# EAGLE schematic Schematic (EAGLE 9.3.2)
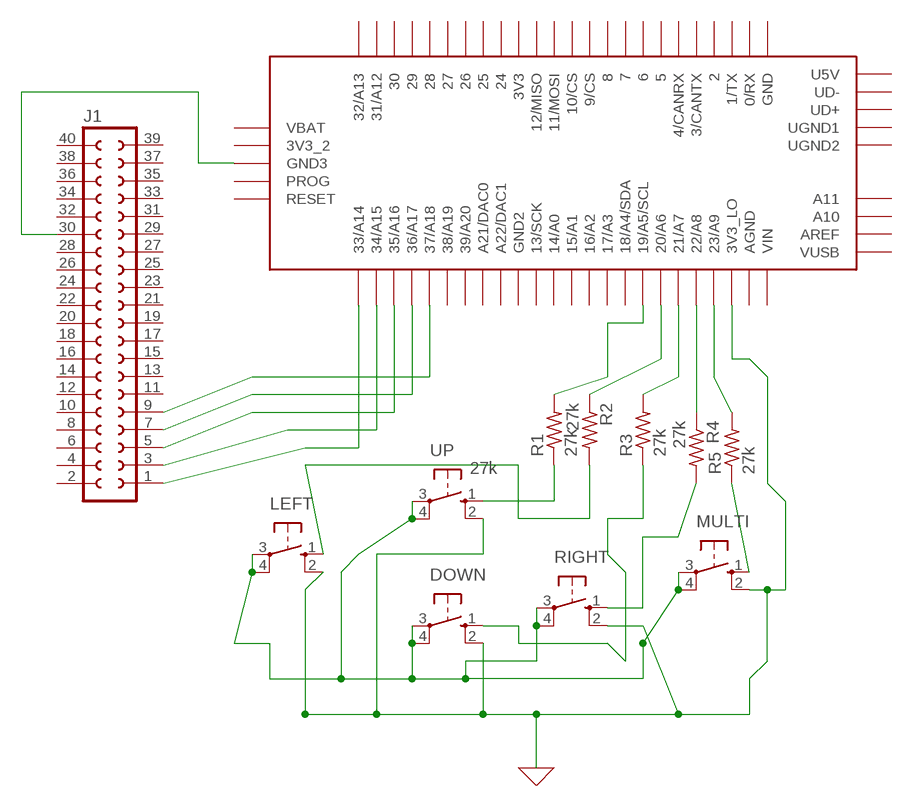
[diagram p0: schematic, sheet 1]

## Parts
DOWN  27k  10-XX  [B3F-10XX]
J1  SOCKET-40V  [S40V]
LEFT  27k  10-XX  [B3F-10XX]
MULTI  27k  10-XX  [B3F-10XX]
R1  27k  R-US_0204/2V  [0204V]
R2  27k  R-US_0204/2V  [0204V]
R3  27k  R-US_0204/2V  [0204V]
R4  27k  R-US_0204/2V  [0204V]
R5  27k  R-US_0204/2V  [0204V]
RIGHT  27k  10-XX  [B3F-10XX]
U$2  TEENSY_3.5/3.6  [TEENSY_3.5/3.6]
UP  27k  10-XX  [B3F-10XX]

## Nets
0: DOWN.2(S1) DOWN.3(P) DOWN.4(P1) LEFT.2(S1) LEFT.3(P) LEFT.4(P1) MULTI.2(S1) MULTI.3(P) MULTI.4(P1) RIGHT.2(S1) RIGHT.3(P) RIGHT.4(P1) U$2.3V3_LO UP.2(S1) UP.3(P) UP.4(P1) ; supply symbol labelled GND
N$1: J1.30 U$2.GND3
N$2: R1.1 UP.1(S)
N$3: LEFT.1(S) R2.2
N$4: R4.2 RIGHT.1(S)
N$5: MULTI.1(S) R5.1
N$6: DOWN.1(S) R3.1
N$8: R4.1 U$2.22/A8
N$10: J1.1 U$2.33/A14
N$11: J1.3 U$2.34/A15
N$12: J1.5 U$2.35/A16
N$13: J1.7 U$2.36/A17
N$14: J1.9 U$2.37/A18
N$15: R5.2 U$2.23/A9
N$17: R3.2 U$2.21/A7
N$18: R2.1 U$2.20/A6
N$19: R1.2 U$2.19/A5/SCL
Unconnected: J1.2 J1.4 J1.6 J1.8 J1.10 J1.11 J1.12 J1.13 J1.14 J1.15 J1.16 J1.17 J1.18 J1.19 J1.20 J1.21 J1.22 J1.23 J1.24 J1.25 J1.26 J1.27 J1.28 J1.29 J1.31 J1.32 J1.33 J1.34 J1.35 J1.36 J1.37 J1.38 J1.39 J1.40 U$2.0/RX U$2.1/TX U$2.2 U$2.3/CANTX U$2.3V3 U$2.3V3_2 U$2.4/CANRX U$2.5 U$2.6 U$2.7 U$2.8 U$2.9/CS U$2.10/CS U$2.11/MOSI U$2.12/MISO U$2.13/SCK U$2.14/A0 U$2.15/A1 U$2.16/A2 U$2.17/A3 U$2.18/A4/SDA U$2.21/DAC0(A21/DAC0) U$2.24 U$2.25 U$2.26 U$2.27 U$2.28 U$2.29 U$2.30 U$2.31/A12 U$2.32/A13 U$2.38/A19 U$2.39/A20 U$2.A10 U$2.A11 U$2.A22/DAC1 U$2.AGND U$2.AREF U$2.GND U$2.GND2 U$2.PROG U$2.RESET U$2.U5V U$2.UD+ U$2.UD- U$2.UGND1 U$2.UGND2 U$2.VBAT U$2.VIN U$2.VUSB

## Library data of the parts
DOWN LEFT MULTI RIGHT UP = switch-omron:10-XX: OMRON SWITCH; MPN: B3F-1000; OC_FARNELL: 176432; OC_NEWARK: 36M3542
J1 = con-3m-skt-header:SOCKET-40: 40 pin PCB Socket (3m 85xx/51xx)
R1-R5 = rcl:R-US_: RESISTOR, American symbol; SPICEPREFIX: R
U$2 = Teensy356:TEENSY_3.5/3.6